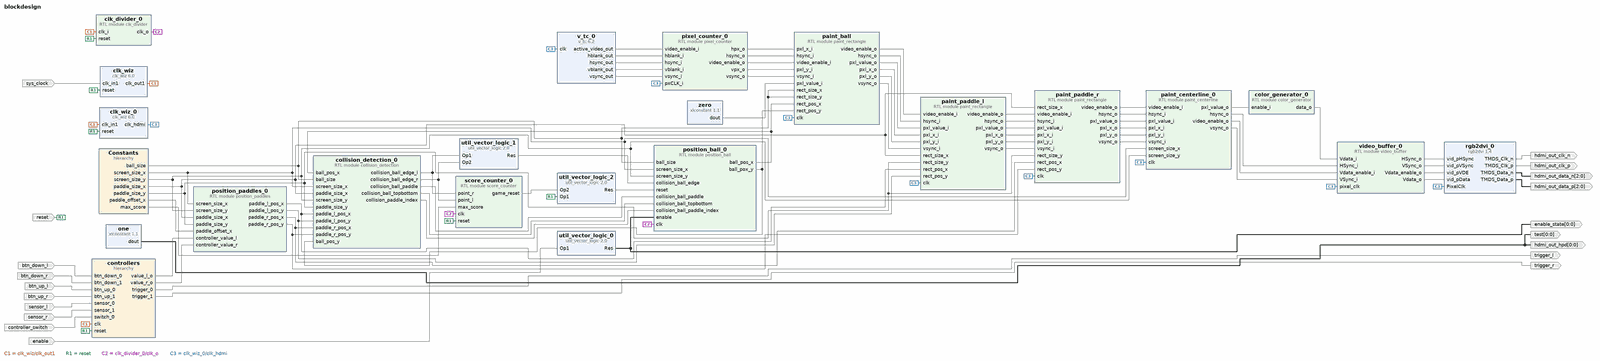
[diagram p0: block diagram of the top level, whole]
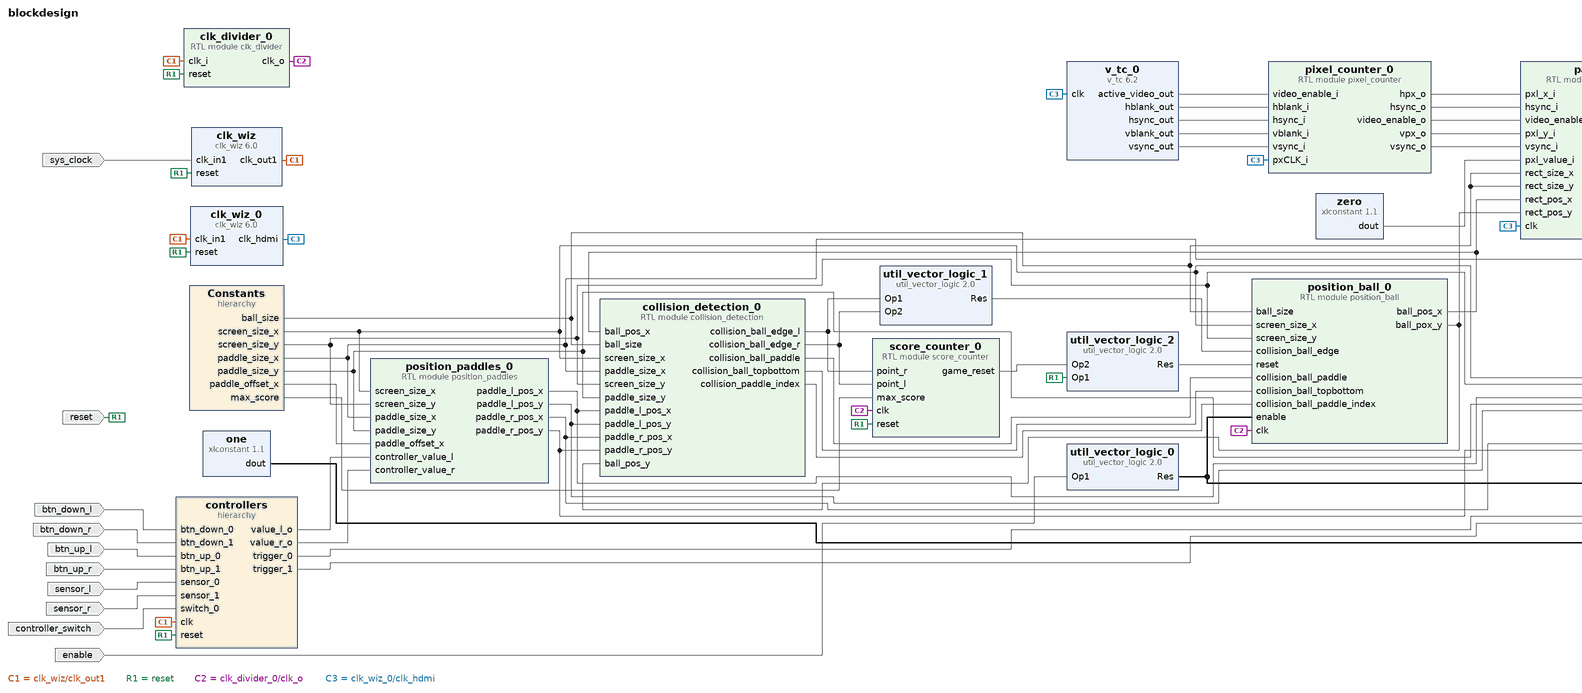
[diagram p1: block diagram of the top level, left part]
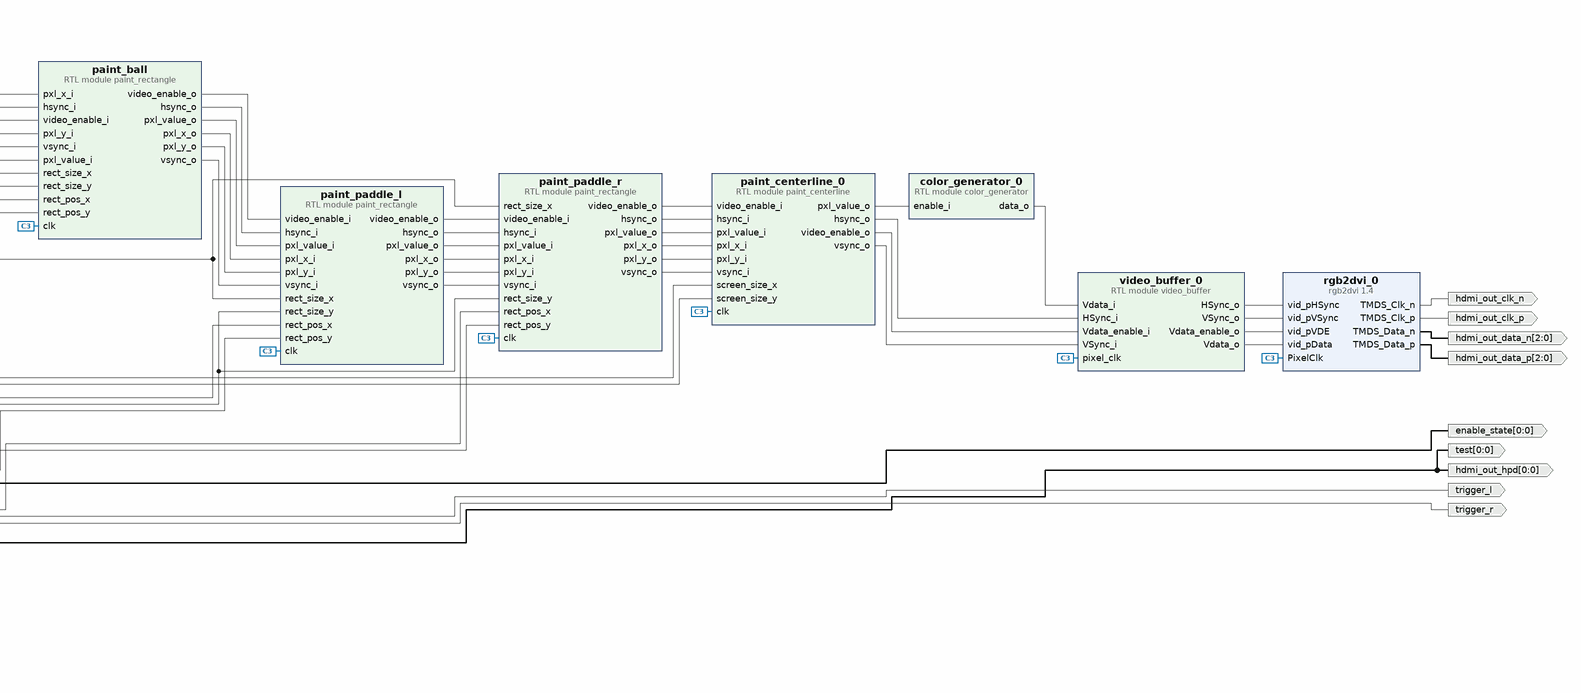
[diagram p2: block diagram of the top level, right part]
# Vivado block design blockdesign, xc7a35tcpg236-1, Vivado 2023.1
create_bd_design blockdesign

create_bd_port -dir O trigger_l
create_bd_port -dir O trigger_r
create_bd_port -dir I sensor_l
create_bd_port -dir I sensor_r
create_bd_port -dir I -type rst reset
set_property -dict {CONFIG.POLARITY ACTIVE_HIGH} [get_bd_ports reset]
create_bd_port -dir I controller_switch
create_bd_port -dir I btn_up_l
create_bd_port -dir I btn_down_l
create_bd_port -dir I btn_up_r
create_bd_port -dir I btn_down_r
create_bd_port -dir I enable
create_bd_port -dir O -from 0 -to 0 hdmi_out_hpd
create_bd_port -dir O -type clk hdmi_out_clk_p
create_bd_port -dir O -type clk hdmi_out_clk_n
create_bd_port -dir O -from 2 -to 0 hdmi_out_data_p
create_bd_port -dir O -from 2 -to 0 hdmi_out_data_n
create_bd_port -dir I -type clk sys_clock
set_property -dict {CONFIG.FREQ_HZ 12000000 CONFIG.PHASE 0.0} [get_bd_ports sys_clock]
create_bd_port -dir O -from 0 -to 0 enable_state
create_bd_port -dir O -from 0 -to 0 test

create_bd_cell -type hier Constants
create_bd_cell -type hier controllers
create_bd_cell -type module -reference clk_divider clk_divider_0
set_property -dict {CONFIG.division 200000} [get_bd_cells clk_divider_0]
create_bd_cell -type ip -vlnv xilinx.com:ip:clk_wiz:6.0 clk_wiz
set_property -dict [list \
  CONFIG.CLKIN1_JITTER_PS 80.0 \
  CONFIG.CLKOUT1_JITTER 124.615 \
  CONFIG.CLKOUT1_PHASE_ERROR 96.948 \
  CONFIG.CLKOUT2_JITTER 124.615 \
  CONFIG.CLKOUT2_PHASE_ERROR 96.948 \
  CONFIG.CLKOUT2_REQUESTED_OUT_FREQ 100.000 \
  CONFIG.CLKOUT2_USED false \
  CONFIG.CLK_IN1_BOARD_INTERFACE sys_clock \
  CONFIG.MMCM_CLKFBOUT_MULT_F 62.500 \
  CONFIG.MMCM_CLKIN1_PERIOD 83.333 \
  CONFIG.MMCM_CLKIN2_PERIOD 10.0 \
  CONFIG.MMCM_CLKOUT0_DIVIDE_F 7.500 \
  CONFIG.MMCM_CLKOUT1_DIVIDE 1 \
  CONFIG.NUM_OUT_CLKS 1 \
  CONFIG.USE_BOARD_FLOW true \
  CONFIG.USE_LOCKED false \
] [get_bd_cells clk_wiz]
create_bd_cell -type ip -vlnv xilinx.com:ip:clk_wiz:6.0 clk_wiz_0
set_property -dict [list \
  CONFIG.CLKOUT1_JITTER 217.614 \
  CONFIG.CLKOUT1_PHASE_ERROR 245.344 \
  CONFIG.CLKOUT1_REQUESTED_OUT_FREQ 148.5 \
  CONFIG.CLK_OUT1_PORT clk_hdmi \
  CONFIG.MMCM_CLKFBOUT_MULT_F 37.125 \
  CONFIG.MMCM_CLKOUT0_DIVIDE_F 6.250 \
  CONFIG.MMCM_DIVCLK_DIVIDE 4 \
  CONFIG.PRIM_IN_FREQ 100.000 \
  CONFIG.USE_LOCKED false \
] [get_bd_cells clk_wiz_0]
create_bd_cell -type module -reference collision_detection collision_detection_0
create_bd_cell -type module -reference color_generator color_generator_0
create_bd_cell -type module -reference paint_centerline paint_centerline_0
create_bd_cell -type module -reference paint_rectangle paint_ball
create_bd_cell -type module -reference paint_rectangle paint_paddle_l
create_bd_cell -type module -reference paint_rectangle paint_paddle_r
create_bd_cell -type module -reference pixel_counter pixel_counter_0
create_bd_cell -type module -reference position_ball position_ball_0
create_bd_cell -type module -reference position_paddles position_paddles_0
create_bd_cell -type module -reference score_counter score_counter_0
create_bd_cell -type ip -vlnv xilinx.com:ip:util_vector_logic:2.0 util_vector_logic_1
set_property -dict {CONFIG.C_OPERATION or CONFIG.C_SIZE 1} [get_bd_cells util_vector_logic_1]
create_bd_cell -type ip -vlnv xilinx.com:ip:util_vector_logic:2.0 util_vector_logic_2
set_property -dict {CONFIG.C_OPERATION or CONFIG.C_SIZE 1} [get_bd_cells util_vector_logic_2]
create_bd_cell -type ip -vlnv xilinx.com:ip:v_tc:6.2 v_tc_0
set_property -dict {CONFIG.HAS_AXI4_LITE false CONFIG.VIDEO_MODE 1080p CONFIG.enable_detection false} [get_bd_cells v_tc_0]
create_bd_cell -type module -reference video_buffer video_buffer_0
create_bd_cell -type ip -vlnv xilinx.com:ip:xlconstant:1.1 zero
set_property -dict {CONFIG.CONST_VAL 0} [get_bd_cells zero]
create_bd_cell -type ip -vlnv xilinx.com:ip:xlconstant:1.1 one
create_bd_cell -type ip -vlnv digilentinc.com:ip:rgb2dvi:1.4 rgb2dvi_0
create_bd_cell -type ip -vlnv xilinx.com:ip:util_vector_logic:2.0 util_vector_logic_0
set_property -dict {CONFIG.C_OPERATION not CONFIG.C_SIZE 1} [get_bd_cells util_vector_logic_0]

# ---- hierarchy /Constants ----
current_bd_instance /Constants
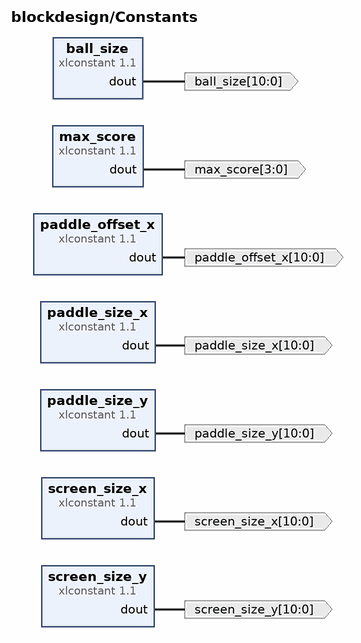
[diagram p3: block diagram inside /Constants]
create_bd_pin -dir O -from 10 -to 0 screen_size_x
create_bd_pin -dir O -from 10 -to 0 screen_size_y
create_bd_pin -dir O -from 10 -to 0 paddle_size_x
create_bd_pin -dir O -from 10 -to 0 paddle_size_y
create_bd_pin -dir O -from 10 -to 0 ball_size
create_bd_pin -dir O -from 10 -to 0 paddle_offset_x
create_bd_pin -dir O -from 3 -to 0 max_score

create_bd_cell -type ip -vlnv xilinx.com:ip:xlconstant:1.1 screen_size_x
set_property -dict {CONFIG.CONST_VAL 1920 CONFIG.CONST_WIDTH 11} [get_bd_cells screen_size_x]
create_bd_cell -type ip -vlnv xilinx.com:ip:xlconstant:1.1 screen_size_y
set_property -dict {CONFIG.CONST_VAL 1080 CONFIG.CONST_WIDTH 11} [get_bd_cells screen_size_y]
create_bd_cell -type ip -vlnv xilinx.com:ip:xlconstant:1.1 paddle_size_x
set_property -dict {CONFIG.CONST_VAL 40 CONFIG.CONST_WIDTH 11} [get_bd_cells paddle_size_x]
create_bd_cell -type ip -vlnv xilinx.com:ip:xlconstant:1.1 paddle_size_y
set_property -dict {CONFIG.CONST_VAL 300 CONFIG.CONST_WIDTH 11} [get_bd_cells paddle_size_y]
create_bd_cell -type ip -vlnv xilinx.com:ip:xlconstant:1.1 ball_size
set_property -dict {CONFIG.CONST_VAL 30 CONFIG.CONST_WIDTH 11} [get_bd_cells ball_size]
create_bd_cell -type ip -vlnv xilinx.com:ip:xlconstant:1.1 paddle_offset_x
set_property -dict {CONFIG.CONST_VAL 0 CONFIG.CONST_WIDTH 11} [get_bd_cells paddle_offset_x]
create_bd_cell -type ip -vlnv xilinx.com:ip:xlconstant:1.1 max_score
set_property -dict {CONFIG.CONST_VAL 3 CONFIG.CONST_WIDTH 4} [get_bd_cells max_score]

# ---- hierarchy /controllers ----
current_bd_instance /controllers
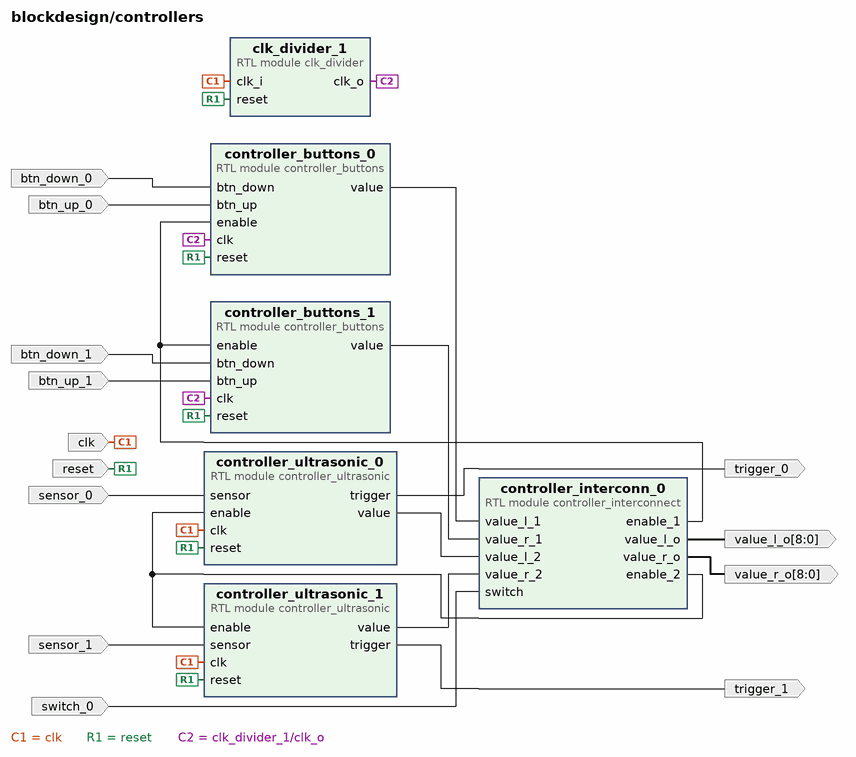
[diagram p4: block diagram inside /controllers]
create_bd_pin -dir I -type clk clk
create_bd_pin -dir I -type rst reset
create_bd_pin -dir I switch_0
create_bd_pin -dir O -from 8 -to 0 value_l_o
create_bd_pin -dir O -from 8 -to 0 value_r_o
create_bd_pin -dir I sensor_0
create_bd_pin -dir O trigger_0
create_bd_pin -dir I sensor_1
create_bd_pin -dir O trigger_1
create_bd_pin -dir I btn_up_1
create_bd_pin -dir I btn_down_1
create_bd_pin -dir I btn_up_0
create_bd_pin -dir I btn_down_0

create_bd_cell -type module -reference clk_divider clk_divider_1
set_property -dict {CONFIG.division 200000} [get_bd_cells clk_divider_1]
create_bd_cell -type module -reference controller_buttons controller_buttons_0
create_bd_cell -type module -reference controller_buttons controller_buttons_1
create_bd_cell -type module -reference controller_interconnect controller_interconn_0
create_bd_cell -type module -reference controller_ultrasonic controller_ultrasonic_0
create_bd_cell -type module -reference controller_ultrasonic controller_ultrasonic_1

# ---- connections ----

current_bd_instance /Constants
connect_bd_net [get_bd_pins screen_size_x/dout] [get_bd_pins screen_size_x]
connect_bd_net [get_bd_pins screen_size_y/dout] [get_bd_pins screen_size_y]
connect_bd_net [get_bd_pins paddle_size_x/dout] [get_bd_pins paddle_size_x]
connect_bd_net [get_bd_pins paddle_size_y/dout] [get_bd_pins paddle_size_y]
connect_bd_net [get_bd_pins ball_size/dout] [get_bd_pins ball_size]
connect_bd_net -net xlconstant_5_dout [get_bd_pins paddle_offset_x/dout] [get_bd_pins paddle_offset_x]
connect_bd_net -net xlconstant_6_dout [get_bd_pins max_score/dout] [get_bd_pins max_score]

current_bd_instance /controllers
connect_bd_net [get_bd_pins clk] [get_bd_pins clk_divider_1/clk_i] [get_bd_pins controller_ultrasonic_0/clk] [get_bd_pins controller_ultrasonic_1/clk]
connect_bd_net [get_bd_pins controller_interconn_0/enable_2] [get_bd_pins controller_ultrasonic_0/enable] [get_bd_pins controller_ultrasonic_1/enable]
connect_bd_net [get_bd_pins reset] \
  [get_bd_pins clk_divider_1/reset] [get_bd_pins controller_buttons_0/reset] [get_bd_pins controller_buttons_1/reset] \
  [get_bd_pins controller_ultrasonic_0/reset] [get_bd_pins controller_ultrasonic_1/reset]
connect_bd_net -net btn_down_0_1 [get_bd_pins btn_down_0] [get_bd_pins controller_buttons_0/btn_down]
connect_bd_net -net btn_down_1_1 [get_bd_pins btn_down_1] [get_bd_pins controller_buttons_1/btn_down]
connect_bd_net -net btn_up_0_1 [get_bd_pins btn_up_0] [get_bd_pins controller_buttons_0/btn_up]
connect_bd_net -net btn_up_1_1 [get_bd_pins btn_up_1] [get_bd_pins controller_buttons_1/btn_up]
connect_bd_net [get_bd_pins clk_divider_1/clk_o] [get_bd_pins controller_buttons_0/clk] [get_bd_pins controller_buttons_1/clk]
connect_bd_net [get_bd_pins controller_buttons_0/value] [get_bd_pins controller_interconn_0/value_l_1]
connect_bd_net [get_bd_pins controller_buttons_1/value] [get_bd_pins controller_interconn_0/value_r_1]
connect_bd_net [get_bd_pins controller_interconn_0/enable_1] [get_bd_pins controller_buttons_0/enable] [get_bd_pins controller_buttons_1/enable]
connect_bd_net [get_bd_pins controller_interconn_0/value_l_o] [get_bd_pins value_l_o]
connect_bd_net [get_bd_pins controller_interconn_0/value_r_o] [get_bd_pins value_r_o]
connect_bd_net [get_bd_pins controller_ultrasonic_0/trigger] [get_bd_pins trigger_0]
connect_bd_net [get_bd_pins controller_ultrasonic_0/value] [get_bd_pins controller_interconn_0/value_l_2]
connect_bd_net [get_bd_pins controller_ultrasonic_1/trigger] [get_bd_pins trigger_1]
connect_bd_net [get_bd_pins controller_ultrasonic_1/value] [get_bd_pins controller_interconn_0/value_r_2]
connect_bd_net -net sensor_0_1 [get_bd_pins sensor_0] [get_bd_pins controller_ultrasonic_0/sensor]
connect_bd_net -net sensor_1_1 [get_bd_pins sensor_1] [get_bd_pins controller_ultrasonic_1/sensor]
connect_bd_net -net switch_0_1 [get_bd_pins switch_0] [get_bd_pins controller_interconn_0/switch]

current_bd_instance /
connect_bd_net [get_bd_pins clk_wiz/clk_out1] [get_bd_pins controllers/clk] [get_bd_pins clk_divider_0/clk_i] [get_bd_pins clk_wiz_0/clk_in1]
connect_bd_net [get_bd_ports reset] \
  [get_bd_pins controllers/reset] [get_bd_pins clk_divider_0/reset] [get_bd_pins clk_wiz/reset] [get_bd_pins clk_wiz_0/reset] \
  [get_bd_pins score_counter_0/reset] [get_bd_pins util_vector_logic_2/Op1]
connect_bd_net [get_bd_pins clk_divider_0/clk_o] [get_bd_pins position_ball_0/clk] [get_bd_pins score_counter_0/clk]
connect_bd_net [get_bd_pins Constants/screen_size_x] \
  [get_bd_pins collision_detection_0/screen_size_x] [get_bd_pins paint_centerline_0/screen_size_x] \
  [get_bd_pins position_ball_0/screen_size_x] [get_bd_pins position_paddles_0/screen_size_x]
connect_bd_net [get_bd_pins Constants/screen_size_y] \
  [get_bd_pins collision_detection_0/screen_size_y] [get_bd_pins paint_centerline_0/screen_size_y] \
  [get_bd_pins position_ball_0/screen_size_y] [get_bd_pins position_paddles_0/screen_size_y]
connect_bd_net [get_bd_pins Constants/paddle_size_x] \
  [get_bd_pins collision_detection_0/paddle_size_x] [get_bd_pins paint_paddle_l/rect_size_x] \
  [get_bd_pins paint_paddle_r/rect_size_x] [get_bd_pins position_paddles_0/paddle_size_x]
connect_bd_net [get_bd_pins Constants/paddle_size_y] \
  [get_bd_pins collision_detection_0/paddle_size_y] [get_bd_pins paint_paddle_l/rect_size_y] \
  [get_bd_pins paint_paddle_r/rect_size_y] [get_bd_pins position_paddles_0/paddle_size_y]
connect_bd_net [get_bd_pins Constants/ball_size] \
  [get_bd_pins collision_detection_0/ball_size] [get_bd_pins paint_ball/rect_size_x] [get_bd_pins paint_ball/rect_size_y] \
  [get_bd_pins position_ball_0/ball_size]
connect_bd_net -net btn_down_0_1 [get_bd_ports btn_down_l] [get_bd_pins controllers/btn_down_0]
connect_bd_net -net btn_down_1_1 [get_bd_ports btn_down_r] [get_bd_pins controllers/btn_down_1]
connect_bd_net -net btn_up_0_1 [get_bd_ports btn_up_l] [get_bd_pins controllers/btn_up_0]
connect_bd_net -net btn_up_1_1 [get_bd_ports btn_up_r] [get_bd_pins controllers/btn_up_1]
connect_bd_net [get_bd_pins clk_wiz_0/clk_hdmi] \
  [get_bd_pins paint_centerline_0/clk] [get_bd_pins paint_ball/clk] [get_bd_pins paint_paddle_l/clk] \
  [get_bd_pins paint_paddle_r/clk] [get_bd_pins pixel_counter_0/pxCLK_i] [get_bd_pins v_tc_0/clk] \
  [get_bd_pins video_buffer_0/pixel_clk] [get_bd_pins rgb2dvi_0/PixelClk]
connect_bd_net [get_bd_pins collision_detection_0/collision_ball_edge_l] [get_bd_pins score_counter_0/point_r] [get_bd_pins util_vector_logic_1/Op1]
connect_bd_net [get_bd_pins collision_detection_0/collision_ball_edge_r] [get_bd_pins score_counter_0/point_l] [get_bd_pins util_vector_logic_1/Op2]
connect_bd_net [get_bd_pins collision_detection_0/collision_ball_paddle] [get_bd_pins position_ball_0/collision_ball_paddle]
connect_bd_net [get_bd_pins collision_detection_0/collision_ball_topbottom] [get_bd_pins position_ball_0/collision_ball_topbottom]
connect_bd_net [get_bd_pins collision_detection_0/collision_paddle_index] [get_bd_pins position_ball_0/collision_ball_paddle_index]
connect_bd_net [get_bd_pins color_generator_0/data_o] [get_bd_pins video_buffer_0/Vdata_i]
connect_bd_net -net controller_interconn_0_value_l_o [get_bd_pins controllers/value_l_o] [get_bd_pins position_paddles_0/controller_value_l]
connect_bd_net -net controller_interconn_0_value_r_o [get_bd_pins controllers/value_r_o] [get_bd_pins position_paddles_0/controller_value_r]
connect_bd_net -net controller_ultrasonic_0_trigger [get_bd_pins controllers/trigger_0] [get_bd_ports trigger_l]
connect_bd_net -net controller_ultrasonic_1_trigger [get_bd_pins controllers/trigger_1] [get_bd_ports trigger_r]
connect_bd_net -net enable_0_1 [get_bd_pins util_vector_logic_0/Res] [get_bd_pins position_ball_0/enable] [get_bd_ports enable_state]
connect_bd_net [get_bd_ports enable] [get_bd_pins util_vector_logic_0/Op1]
connect_bd_net [get_bd_pins one/dout] [get_bd_ports hdmi_out_hpd] [get_bd_ports test]
connect_bd_net [get_bd_pins paint_ball/video_enable_o] [get_bd_pins paint_paddle_l/video_enable_i]
connect_bd_net [get_bd_pins paint_centerline_0/hsync_o] [get_bd_pins video_buffer_0/HSync_i]
connect_bd_net [get_bd_pins paint_centerline_0/pxl_value_o] [get_bd_pins color_generator_0/enable_i]
connect_bd_net [get_bd_pins paint_centerline_0/video_enable_o] [get_bd_pins video_buffer_0/Vdata_enable_i]
connect_bd_net [get_bd_pins paint_centerline_0/vsync_o] [get_bd_pins video_buffer_0/VSync_i]
connect_bd_net [get_bd_pins paint_paddle_l/video_enable_o] [get_bd_pins paint_paddle_r/video_enable_i]
connect_bd_net [get_bd_pins paint_paddle_r/video_enable_o] [get_bd_pins paint_centerline_0/video_enable_i]
connect_bd_net -net paint_rectangle_0_hsync_o [get_bd_pins paint_ball/hsync_o] [get_bd_pins paint_paddle_l/hsync_i]
connect_bd_net -net paint_rectangle_0_pxl_value_o [get_bd_pins paint_ball/pxl_value_o] [get_bd_pins paint_paddle_l/pxl_value_i]
connect_bd_net -net paint_rectangle_0_pxl_x_o [get_bd_pins paint_ball/pxl_x_o] [get_bd_pins paint_paddle_l/pxl_x_i]
connect_bd_net -net paint_rectangle_0_pxl_y_o [get_bd_pins paint_ball/pxl_y_o] [get_bd_pins paint_paddle_l/pxl_y_i]
connect_bd_net -net paint_rectangle_0_vsync_o [get_bd_pins paint_ball/vsync_o] [get_bd_pins paint_paddle_l/vsync_i]
connect_bd_net -net paint_rectangle_1_hsync_o [get_bd_pins paint_paddle_l/hsync_o] [get_bd_pins paint_paddle_r/hsync_i]
connect_bd_net -net paint_rectangle_1_pxl_value_o [get_bd_pins paint_paddle_l/pxl_value_o] [get_bd_pins paint_paddle_r/pxl_value_i]
connect_bd_net -net paint_rectangle_1_pxl_x_o [get_bd_pins paint_paddle_l/pxl_x_o] [get_bd_pins paint_paddle_r/pxl_x_i]
connect_bd_net -net paint_rectangle_1_pxl_y_o [get_bd_pins paint_paddle_l/pxl_y_o] [get_bd_pins paint_paddle_r/pxl_y_i]
connect_bd_net -net paint_rectangle_1_vsync_o [get_bd_pins paint_paddle_l/vsync_o] [get_bd_pins paint_paddle_r/vsync_i]
connect_bd_net -net paint_rectangle_2_hsync_o [get_bd_pins paint_paddle_r/hsync_o] [get_bd_pins paint_centerline_0/hsync_i]
connect_bd_net -net paint_rectangle_2_pxl_value_o [get_bd_pins paint_paddle_r/pxl_value_o] [get_bd_pins paint_centerline_0/pxl_value_i]
connect_bd_net -net paint_rectangle_2_pxl_x_o [get_bd_pins paint_paddle_r/pxl_x_o] [get_bd_pins paint_centerline_0/pxl_x_i]
connect_bd_net -net paint_rectangle_2_pxl_y_o [get_bd_pins paint_paddle_r/pxl_y_o] [get_bd_pins paint_centerline_0/pxl_y_i]
connect_bd_net -net paint_rectangle_2_vsync_o [get_bd_pins paint_paddle_r/vsync_o] [get_bd_pins paint_centerline_0/vsync_i]
connect_bd_net [get_bd_pins pixel_counter_0/hpx_o] [get_bd_pins paint_ball/pxl_x_i]
connect_bd_net [get_bd_pins pixel_counter_0/hsync_o] [get_bd_pins paint_ball/hsync_i]
connect_bd_net [get_bd_pins pixel_counter_0/video_enable_o] [get_bd_pins paint_ball/video_enable_i]
connect_bd_net [get_bd_pins pixel_counter_0/vpx_o] [get_bd_pins paint_ball/pxl_y_i]
connect_bd_net [get_bd_pins pixel_counter_0/vsync_o] [get_bd_pins paint_ball/vsync_i]
connect_bd_net [get_bd_pins position_ball_0/ball_pos_x] [get_bd_pins collision_detection_0/ball_pos_x] [get_bd_pins paint_ball/rect_pos_x]
connect_bd_net [get_bd_pins position_ball_0/ball_pox_y] [get_bd_pins collision_detection_0/ball_pos_y] [get_bd_pins paint_ball/rect_pos_y]
connect_bd_net [get_bd_pins position_paddles_0/paddle_l_pos_x] \
  [get_bd_pins collision_detection_0/paddle_l_pos_x] [get_bd_pins paint_paddle_l/rect_pos_x]
connect_bd_net [get_bd_pins position_paddles_0/paddle_l_pos_y] \
  [get_bd_pins collision_detection_0/paddle_l_pos_y] [get_bd_pins paint_paddle_l/rect_pos_y]
connect_bd_net [get_bd_pins position_paddles_0/paddle_r_pos_x] \
  [get_bd_pins collision_detection_0/paddle_r_pos_x] [get_bd_pins paint_paddle_r/rect_pos_x]
connect_bd_net [get_bd_pins position_paddles_0/paddle_r_pos_y] \
  [get_bd_pins collision_detection_0/paddle_r_pos_y] [get_bd_pins paint_paddle_r/rect_pos_y]
connect_bd_net [get_bd_pins rgb2dvi_0/TMDS_Clk_n] [get_bd_ports hdmi_out_clk_n]
connect_bd_net [get_bd_pins rgb2dvi_0/TMDS_Clk_p] [get_bd_ports hdmi_out_clk_p]
connect_bd_net [get_bd_pins rgb2dvi_0/TMDS_Data_n] [get_bd_ports hdmi_out_data_n]
connect_bd_net [get_bd_pins rgb2dvi_0/TMDS_Data_p] [get_bd_ports hdmi_out_data_p]
connect_bd_net [get_bd_pins score_counter_0/game_reset] [get_bd_pins util_vector_logic_2/Op2]
connect_bd_net -net sensor_0_1 [get_bd_ports sensor_l] [get_bd_pins controllers/sensor_0]
connect_bd_net -net sensor_1_1 [get_bd_ports sensor_r] [get_bd_pins controllers/sensor_1]
connect_bd_net -net switch_0_1 [get_bd_ports controller_switch] [get_bd_pins controllers/switch_0]
connect_bd_net [get_bd_ports sys_clock] [get_bd_pins clk_wiz/clk_in1]
connect_bd_net [get_bd_pins util_vector_logic_1/Res] [get_bd_pins position_ball_0/collision_ball_edge]
connect_bd_net [get_bd_pins util_vector_logic_2/Res] [get_bd_pins position_ball_0/reset]
connect_bd_net [get_bd_pins v_tc_0/active_video_out] [get_bd_pins pixel_counter_0/video_enable_i]
connect_bd_net [get_bd_pins v_tc_0/hblank_out] [get_bd_pins pixel_counter_0/hblank_i]
connect_bd_net [get_bd_pins v_tc_0/hsync_out] [get_bd_pins pixel_counter_0/hsync_i]
connect_bd_net [get_bd_pins v_tc_0/vblank_out] [get_bd_pins pixel_counter_0/vblank_i]
connect_bd_net [get_bd_pins v_tc_0/vsync_out] [get_bd_pins pixel_counter_0/vsync_i]
connect_bd_net [get_bd_pins video_buffer_0/HSync_o] [get_bd_pins rgb2dvi_0/vid_pHSync]
connect_bd_net [get_bd_pins video_buffer_0/VSync_o] [get_bd_pins rgb2dvi_0/vid_pVSync]
connect_bd_net [get_bd_pins video_buffer_0/Vdata_enable_o] [get_bd_pins rgb2dvi_0/vid_pVDE]
connect_bd_net [get_bd_pins video_buffer_0/Vdata_o] [get_bd_pins rgb2dvi_0/vid_pData]
connect_bd_net -net xlconstant_5_dout [get_bd_pins Constants/paddle_offset_x] [get_bd_pins position_paddles_0/paddle_offset_x]
connect_bd_net -net xlconstant_6_dout [get_bd_pins Constants/max_score] [get_bd_pins score_counter_0/max_score]
connect_bd_net [get_bd_pins zero/dout] [get_bd_pins paint_ball/pxl_value_i]

validate_bd_design
save_bd_design
